# Altium schematic sheet Interface.SchDoc
size A4; Organization: Altium Limited; Address1: L3, 12a Rodborough Rd; Address2: Frenchs Forest; Address3: NSW; Address4: Australia 2086
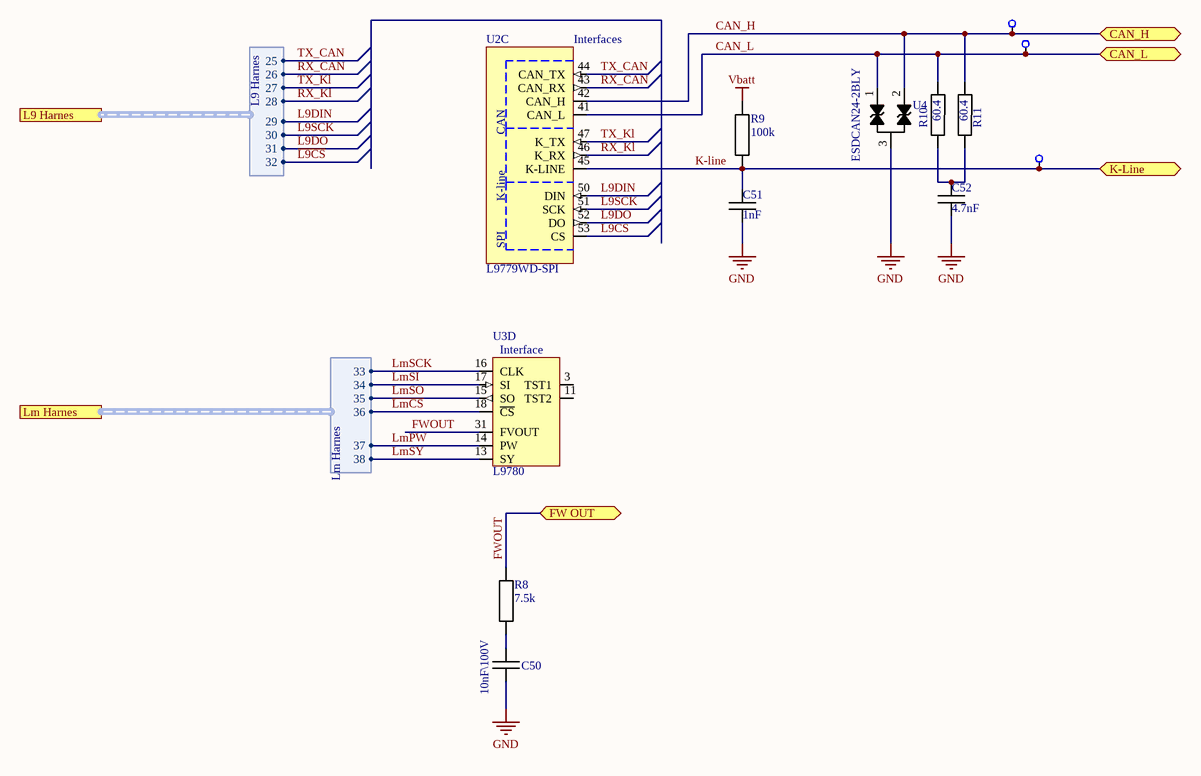
[diagram p0: Interface.SchDoc]

## Parts
C50  10nF\100V  [SMD 0603]
C51  1nF  [SMD 0603]
C52  4.7nF  [SMD 0603]
R8  7.5k  [SMD 0603]
R9  100k  [SMD 0603]
R10  60.4  [SMD 0603]
R11  60.4  [SMD 0603]
TP31  TestPoint  [TESTPOINT]  (value not drawn)
TP32  TestPoint  [TESTPOINT]  (value not drawn)
TP33  TestPoint  [TESTPOINT]  (value not drawn)
U2  L9779WD-SPI  [HiQUAD-64]  (part C of 6)
U3  L9780  [LQFP-48N]  (part D of 4)
U4  ESDCAN24-2BLY  [SOT23]

## Ports
CAN_H (bidir), CAN_L (bidir), FW OUT (bidir), K-Line (bidir), L9 Harnes (harness L9 Harnes), Lm Harnes (harness Lm Harnes)

## Harnesses
L9 Harnes: 25, 26, 27, 28, 29, 30, 31, 32
Lm Harnes: 33, 34, 35, 36, 37, 38

## Nets
GND: C50.1 C51.1 C52.1 U4.3
Vbatt: R9.2
~{L9CS}: U2.53(CS) ; port L9 Harnes.32
~{LmCS}: U3.18(~{CS}) ; port Lm Harnes.36
CAN_H: R11.2 TP31.0 U2.42(CAN_H) U4.2 ; port CAN_H
CAN_L: R10.2 TP32.0 U2.41(CAN_L) U4.1 ; port CAN_L
FWOUT: R8.1 U3.31(FVOUT) ; port FW OUT
K-line: C51.2 R9.1 TP33.0 U2.45(K-LINE) ; port K-Line
L9DIN: U2.50(DIN) ; port L9 Harnes.29
L9DO: U2.52(DO) ; port L9 Harnes.31
L9SCK: U2.51(SCK) ; port L9 Harnes.30
LmPW: U3.14(PW) ; port Lm Harnes.37
LmSCK: U3.16(CLK) ; port Lm Harnes.33
LmSI: U3.17(SI) ; port Lm Harnes.34
LmSO: U3.15(SO) ; port Lm Harnes.35
LmSY: U3.13(SY) ; port Lm Harnes.38
RX_CAN: U2.43(CAN_RX) ; port L9 Harnes.26
RX_Kl: U2.46(K_RX) ; port L9 Harnes.28
TX_CAN: U2.44(CAN_TX) ; port L9 Harnes.25
TX_Kl: U2.47(K_TX) ; port L9 Harnes.27
NetC50_2: C50.2 R8.2
NetC52_2: C52.2 R10.1 R11.1

Not connected (* = marked no-connect by the designer): U3 3(TST1) 11(TST2)

## Notes on the sheet
- Title
- Size:
- Date:
- A4
- Number:
- Time:
- Revision:
- Sheet
- of
- File:
- (in symbol L9779WD-SPI, part C) Interfaces; CAN; K-line; SPI
- (in symbol L9780, part D) Interface

## Library data of the parts
C50 = Capasitor: CC0603KRX7R0BB103; Value: 10nF\100V
C51 = Capasitor: CC0603KRX7R9BB102; Value: 1nF
C52 = Capasitor: CC0603KRX7R9BB472; Value: 4.7nF
R8 = Resistor: RC0603FR-077K5L; Value: 7.5k
R9 = Resistor: RT0603BRD07100KL; Value: 100k
R10 R11 = Resistor: RC0603FR-0760R4L; Value: 60.4
U2 = L9779WD-SPI: Multifunction IC for engine management system
U3 = L9780: Wide range air fuel sensor control interface
U4 = ESDCANxx-2BLY